# EAGLE design powermeter (EAGLE 9.6.2)
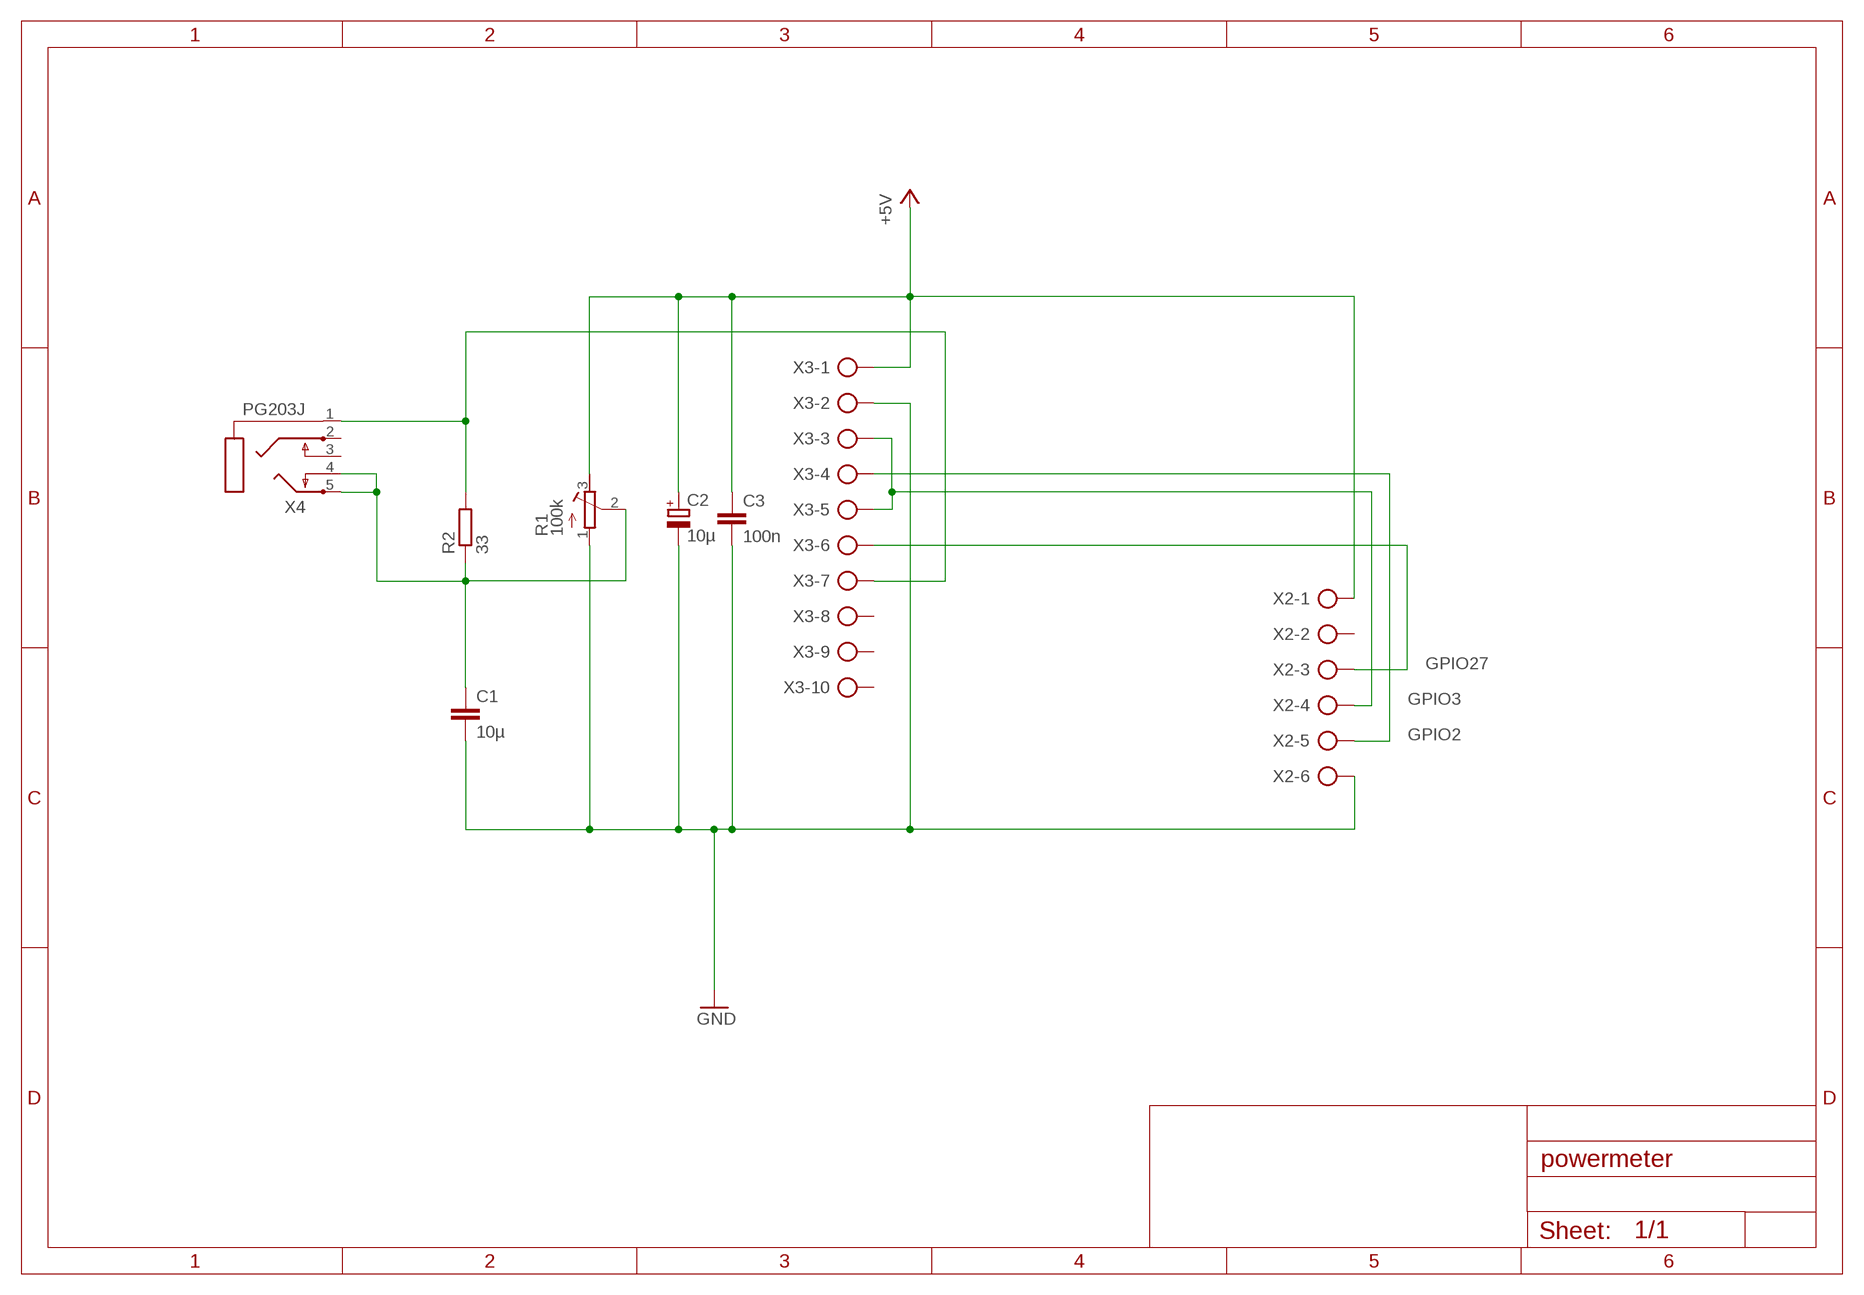
[diagram p0: schematic, sheet 1]

## Parts
C1  10µ  C-EU050-025X075  [C050-025X075]
C2  10µ  CPOL-EUE5-10.5  [E5-10,5]
C3  100n  C-EU050-025X075  [C050-025X075]
R1  100k  R-TRIMM64W  [RTRIM64W]
R2  33  R-EU_0309/12  [0309/12]
X2  AK300/6  [AK300/6]
X3  AK300/10  [AK300/10]
X4  PG203J  [PG203J]

## Nets
+5V: C2.+ C3.1 R1.3(E) X2.1 X3.1
GND: C1.2 C2.- C3.2 R1.1(A) X2.6 X3.2
GPIO2: X2.5 X3.4
GPIO3: X2.4 X3.3 X3.5
GPIO27: X2.3 X3.6
N$1: R2.2 X3.7 X4.1
N$4: C1.1 R1.2(S) R2.1 X4.4 X4.5
Unconnected: X2.2 X3.8 X3.9 X3.10 X4.2 X4.3

## Library data of the parts
C1 C3 = rcl:C-EU: CAPACITOR, European symbol; SPICEPREFIX: C
C2 = rcl:CPOL-EU: POLARIZED CAPACITOR, European symbol; SPICEPREFIX: C
R1 = rcl:R-TRIMM: Trimm resistor; SPICEMODEL: X; SPICEPREFIXL: POT
R2 = rcl:R-EU_: RESISTOR, European symbol; SPICEPREFIX: R
X2 = con-ptr500:AK300/6: CONNECTOR; OC_FARNELL: unknown; OC_NEWARK: unknown
X3 = con-ptr500:AK300/10: CONNECTOR; OC_FARNELL: unknown; OC_NEWARK: unknown
X4 = con-hirschmann:PG203J: MIC/HEADPHONE JACK KS-S stereo microphone/headphone jack PG203JN (Schukat); OC_FARNELL: unknown; OC_NEWARK: unknown

## Board
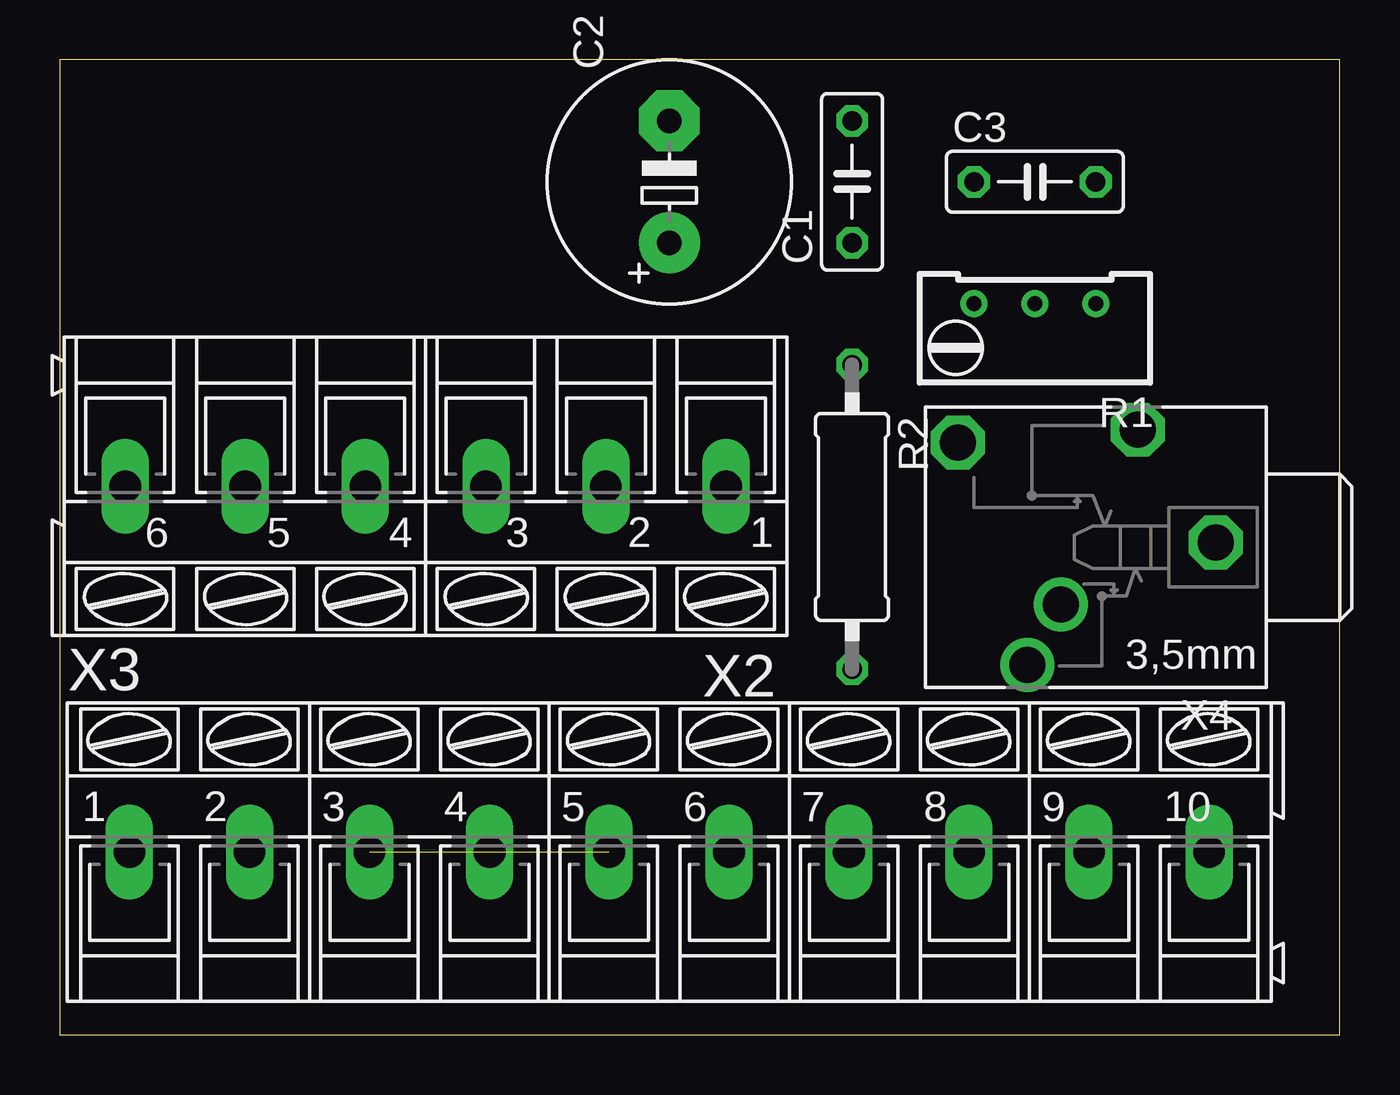
[diagram p1: board, top side]
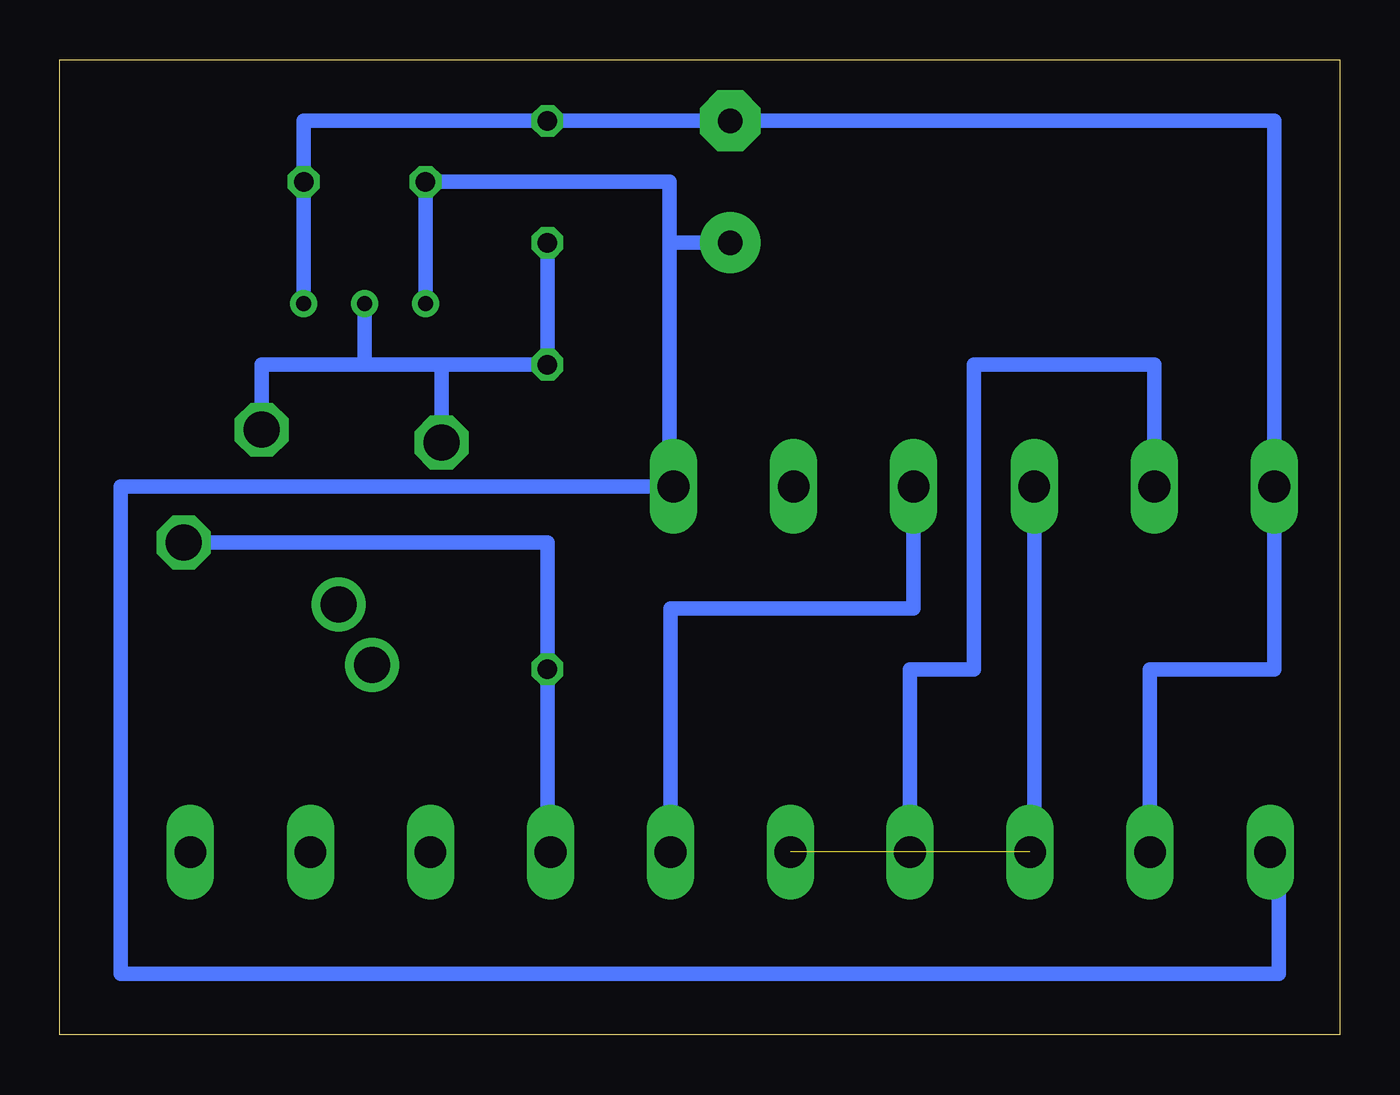
[diagram p2: board, bottom side, seen from below]

Size 53.34 x 40.64 mm. Coordinates in mm from the lower left corner, seen from the top.
Outline: 0,0 53.34,0 53.34,40.64 0,40.64 0,0
Copper layers (1*16): Top 0.035mm / dielectric 1.5mm / Bottom 0.035mm
Design rules "default": minimum track width 6mil, minimum drill 0.35mm, track to track 6mil, track to pad 6mil, pad to pad 6mil, via to via 6mil, smd to smd 6mil, copper to edge 40mil, drill to drill 6mil, minimum pad ring 10mil, minimum via ring 8mil, stop-mask expansion 4mil, vias tented up to drill 0mil, thermal gap 10mil

### Footprints (pad centres in the part's own frame; a part is rotated, then mirrored left to right if it is on the bottom)
C050-025X075 = drill 0.813 octagon: 1 -2.54,0; 2 2.54,0
E5-10,5 = drill 1.016 pad 2.54: + -2.54,0 | drill 1.016 pad 2.54 octagon: - 2.54,0
RTRIM64W = drill 0.61: 1 1.27,-2.54; 2 1.27,0; 3 1.27,2.54
0309/12 = drill 0.813 octagon: 1 -6.35,0; 2 6.35,0
AK300/6 = drill 1.321 long: 1 -12.522,0; 2 -7.518,0; 3 -2.515,0; 4 2.515,0; 5 7.518,0; 6 12.522,0
AK300/10 = drill 1.321 long: 1 -22.504,0; 2 -17.501,0; 3 -12.497,0; 4 -7.493,0; 5 -2.515,0; 6 2.489,0; 7 7.493,0; 8 12.497,0; 9 17.501,0; 10 22.504,0
PG203J = drill 1.499 octagon: 1 -5.004,-0.203; 4 5.74,-4.369; 5 -1.753,-4.902 | drill 1.499: 2 2.845,4.902; 3 1.448,2.388

### Placement (x,y rotation side)
C1  33.02,35.56 90 top
C2  25.4,35.56 90 top
C3  40.64,35.56 0 top
R1  40.64,29.21 90 top
R2  33.02,21.59 270 top
X2  15.24,22.86 180 top
X3  25.4,7.62 0 top
X4  43.18,20.32 180 top

### Tracks (layer width: path | path; a pad name or v marks a point on that pad's centre or on a via)
+5V
  Bottom 0.61: R1.3 C3.1 27.94,35.56 27.94,33.02 | 27.94,33.02 27.94,22.86 | 27.94,22.86 X2.1 | C2.+ 27.94,33.02 | X3.1 2.54,7.62 2.54,2.54 50.8,2.54 50.8,22.86 27.94,22.86
GND
  Bottom 0.61: X3.2 7.9,15.24 2.72,15.24 X2.6 2.72,38.1 C2.- C1.2 43.18,38.1 C3.2 R1.1
GPIO2
  Bottom 0.61: X2.5 7.72,27.94 15.24,27.94 15.24,15.24 17.91,15.24 X3.4
GPIO3  (1 unrouted)
  Bottom 0.61: X3.3 12.72,7.62 X2.4
GPIO27
  Bottom 0.61: X2.3 17.75,17.78 27.89,17.78 X3.6
N$1
  Bottom 0.61: X3.7 33.02,7.62 R2.2 33.02,20.52 X4.1
N$4
  Bottom 0.61: 37.44,27.94 R2.1 C1.1 | 37.44,27.94 40.64,27.94 | 40.64,27.94 44.93,27.94 X4.5 | R1.2 40.64,27.94 | X4.4 37.44,27.94